# Altium schematic sheet sensors.SchDoc
size A4
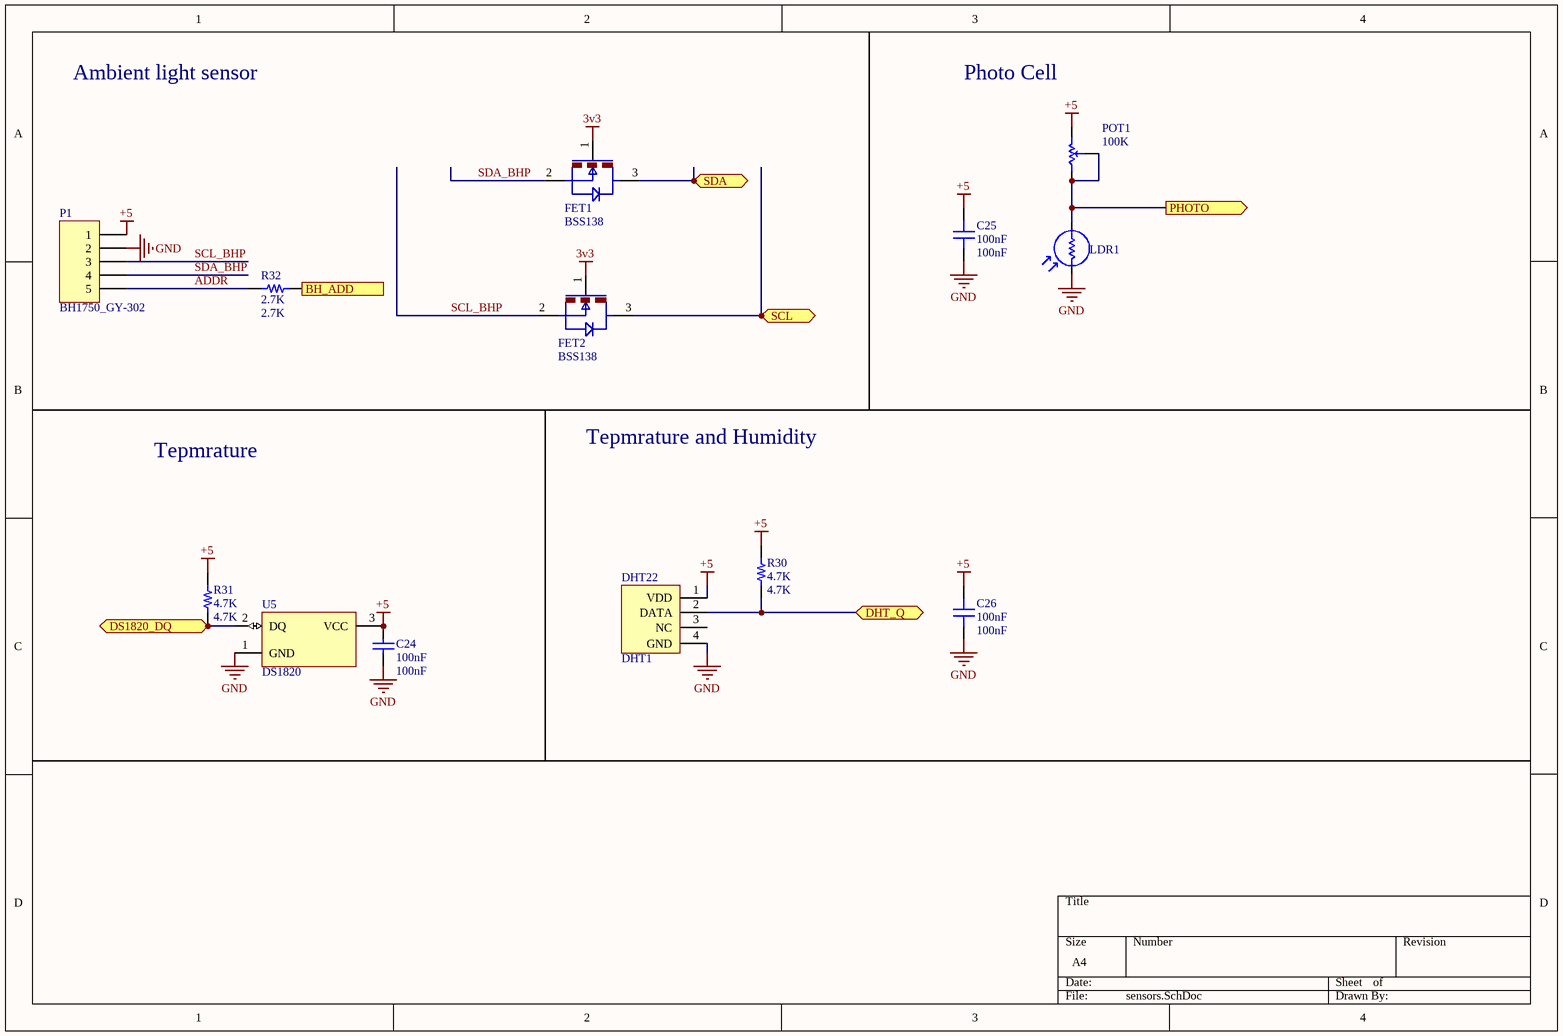
[diagram p0: sensors.SchDoc]

## Parts
C24  100nF  [0603C]
C25  100nF  [0603C]
C26  100nF  [0603C]
DHT1  DHT22  [DHT22]
FET1  BSS138  [SOT-23]
FET2  BSS138  [SOT-23]
LDR1  PhotoCell-5mm  [PhotoCell]  (value not drawn)
P1  BH1750_GY-302  [BH1750]
POT1  100K  [POT 2]
R30  4.7K  [0603R]
R31  4.7K  [0603R]
R32  2.7K  [0603R]
U5  DS1820  [DS1820]

## Ports
BH_ADD (in), DHT_Q (bidir), DS1820_DQ (bidir), PHOTO (out), SCL (bidir), SDA (bidir)

## Nets
3v3: FET1.1(G) FET2.1(G)
+5: C24.2 C25.1 C26.1 DHT1.1(VDD) P1.1 POT1.2(CW) R30.2 R31.2 U5.3(VCC)
GND: C24.1 C25.2 C26.2 DHT1.4(GND) LDR1.1 P1.2 U5.1(GND)
ADDR: P1.5 R32.2
BH_ADD: R32.1 ; port BH_ADD
DHT_Q: DHT1.2(DATA) R30.1 ; port DHT_Q
DS1820_DQ: R31.1 U5.2(DQ) ; port DS1820_DQ
PHOTO: LDR1.2 POT1.1(CCW) POT1.3(SetPoint) ; port PHOTO
SCL: FET2.3(D) ; port SCL
SCL_BHP: FET2.2(S) P1.3
SDA: FET1.3(D) ; port SDA
SDA_BHP: FET1.2(S) P1.4

Not connected (* = marked no-connect by the designer): DHT1 3(NC)

## Notes on the sheet
- Ambient light sensor
- Photo Cell
- Tepmrature and Humidity
- Tepmrature

## Library data of the parts
C24 = Cap: CAP SMD 0603; Published: 8-Jun-2000; LatestRevisionDate: 17-Jul-2002; LatestRevisionNote: Re-released for DXP Platform.; PackageReference: RAD-0.3; Publisher: Altium Limited; PackageDescription: Radial Cap, Thru-Hole; 2 Leads; 0.3 in Pin Spacing; Value: 100nF
C25 C26 = Capacitor: CAP SMD 0603; Part Number: C0805X106K9RAC7800; Value: 100nF
DHT1 = DHT22: Temprature & Humidity Sensor
FET1 FET2 = BSS138: MOSFET N-channel SMD
LDR1 = LDR: Photo Cell- Variable Resistor With Light; Company: IPA CO.; Designer: Saeid Jorablo; Last Update Time: 2008/07/17
P1 = Header 5: Ambiant light sensor; LatestRevisionDate: 17-Jul-2002; LatestRevisionNote: Re-released for DXP Platform.; Publisher: Altium Limited
POT1 = POT: Variable Resistor; Value: 100K
R30-R32 = Resistor: RES SMD 0603; Part Number: RCS0805100KFKEA
  R30 R31: Value: 4.7K
  R32: Value: 2.7K
U5 = DS1820: 1-Wire Digital Thermometer; ComponentAvailability: Obsolete; Published: 13-Oct-2000; LatestRevisionDate: 17-Jul-2002; LatestRevisionNote: Re-released for DXP Platform.; DatasheetVersion: 5-Mar-1998; PackageVersion: 1999; PackageReference: PR35; Publisher: Altium Limited; PackageDescription: TO, Flat Index; 3 In-Line, Axial Leads; Body Dia. 4.6mm; Leads 0.56 x 0.51 mm (max); ComponentLink1Description: Manufacturer Link; ComponentLink1URL: http://www.maxim-ic.com/; ComponentLink2Description: Datasheet; ComponentLink2URL: http://pdfserv.maxim-ic.com/en/ds/DS1820-DS1820S.pdf; ComponentLink3Description: Discontinuation Notice; ComponentLink3URL: http://www.maxim-ic.com/qa/pdfs/non-obsolescence-letter.pdf